# Altium schematic sheet USBtoUART.SchDoc
size A
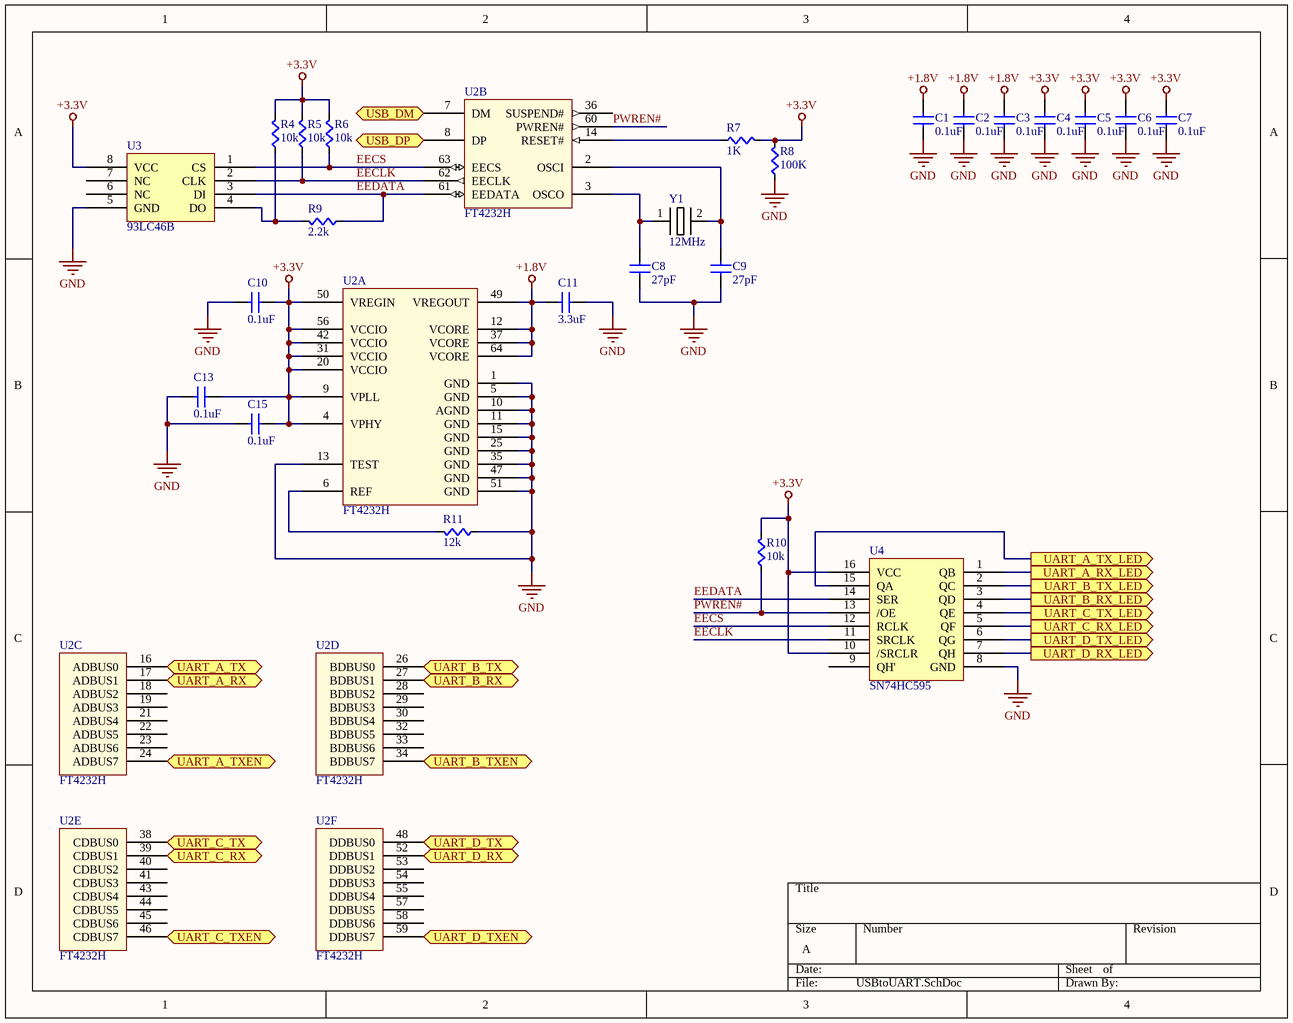
[diagram p0: USBtoUART.SchDoc]

## Parts
C1  value 0.1uF  [CAPC0603]  (hidden comment: Cap)
C2  value 0.1uF  [CAPC0603]  (hidden comment: Cap)
C3  value 0.1uF  [CAPC0603]  (hidden comment: Cap)
C4  value 0.1uF  [CAPC0603]  (hidden comment: Cap)
C5  value 0.1uF  [CAPC0603]  (hidden comment: Cap)
C6  value 0.1uF  [CAPC0603]  (hidden comment: Cap)
C7  value 0.1uF  [CAPC0603]  (hidden comment: Cap)
C8  value 27pF  [CAPC0603]  (hidden comment: Cap)
C9  value 27pF  [CAPC0603]  (hidden comment: Cap)
C10  value 0.1uF  [CAPC0603]  (hidden comment: Cap)
C11  value 3.3uF  [CAPC0603]  (hidden comment: Cap)
C13  value 0.1uF  [CAPC0603]  (hidden comment: Cap)
C15  value 0.1uF  [CAPC0603]  (hidden comment: Cap)
R4  value 10k  [RES0603]  (hidden comment: Res)
R5  value 10k  [RES0603]  (hidden comment: Res)
R6  value 10k  [RES0603]  (hidden comment: Res)
R7  value 1K  [RES0603]  (hidden comment: Res)
R8  value 100K  [RES0603]  (hidden comment: Res)
R9  value 2.2k  [RES0603]  (hidden comment: Res)
R10  value 10k  [RES0603]  (hidden comment: Res)
R11  value 12k  [RES0603]  (hidden comment: Res)
U2  FT4232H  [FT4232HL]  (parts A,B,C,D,E,F of 6)
U3  93LC46B  [SOIC-8pin]
U4  SN74HC595  [TSSOP-16pin]
Y1  12MHz  [HC49/US]

## Ports
UART_A_RX (in), UART_A_RX_LED (out), UART_A_TX (out), UART_A_TX_LED (out), UART_A_TXEN (out), UART_B_RX (in), UART_B_RX_LED (out), UART_B_TX (out), UART_B_TX_LED (out), UART_B_TXEN (out), UART_C_RX (in), UART_C_RX_LED (out), UART_C_TX (out), UART_C_TX_LED (out), UART_C_TXEN (out), UART_D_RX (in), UART_D_RX_LED (out), UART_D_TX (out), UART_D_TX_LED (out), UART_D_TXEN (out), USB_DM (bidir), USB_DP (bidir)

## Nets
+1.8V: C1.2(B) C2.2(B) C3.2(B) C11.1(A) U2.12(VCORE) U2.37(VCORE) U2.49(VREGOUT) U2.64(VCORE)
+3.3V: C4.2(B) C5.2(B) C6.2(B) C7.2(B) C10.2(B) C13.2(B) C15.1(A) R4.1(A) R5.1(A) R6.1(A) R7.1(A) R8.1(A) R10.1(A) U2.4(VPHY) U2.9(VPLL) U2.20(VCCIO) U2.31(VCCIO) U2.42(VCCIO) U2.50(VREGIN) U2.56(VCCIO) U3.8(VCC) U4.10(/SRCLR) U4.16(VCC)
GND: C1.1(A) C2.1(A) C3.1(A) C4.1(A) C5.1(A) C6.1(A) C7.1(A) C8.2(B) C9.2(B) C10.1(A) C11.2(B) C13.1(A) C15.2(B) R8.2(B) R11.2(B) U2.1(GND) U2.5(GND) U2.10(AGND) U2.11(GND) U2.13(TEST) U2.15(GND) U2.25(GND) U2.35(GND) U2.47(GND) U2.51(GND) U3.5(GND) U4.8(GND)
EECLK: R5.2(B) U2.62(EECLK) U3.2(CLK) U4.11(SRCLK)
EECS: R6.2(B) U2.63(EECS) U3.1(CS) U4.12(RCLK)
EEDATA: R9.2(B) U2.61(EEDATA) U3.3(DI) U4.14(SER)
PWREN#: R10.2(B) U2.60(PWREN#) U4.13(/OE)
UART_A_RX: U2.17(ADBUS1) ; port UART_A_RX
UART_A_RX_LED: U4.1(QB) ; port UART_A_RX_LED
UART_A_TX: U2.16(ADBUS0) ; port UART_A_TX
UART_A_TX_LED: U4.15(QA) ; port UART_A_TX_LED
UART_A_TXEN: U2.24(ADBUS7) ; port UART_A_TXEN
UART_B_RX: U2.27(BDBUS1) ; port UART_B_RX
UART_B_RX_LED: U4.3(QD) ; port UART_B_RX_LED
UART_B_TX: U2.26(BDBUS0) ; port UART_B_TX
UART_B_TX_LED: U4.2(QC) ; port UART_B_TX_LED
UART_B_TXEN: U2.34(BDBUS7) ; port UART_B_TXEN
UART_C_RX: U2.39(CDBUS1) ; port UART_C_RX
UART_C_RX_LED: U4.5(QF) ; port UART_C_RX_LED
UART_C_TX: U2.38(CDBUS0) ; port UART_C_TX
UART_C_TX_LED: U4.4(QE) ; port UART_C_TX_LED
UART_C_TXEN: U2.46(CDBUS7) ; port UART_C_TXEN
UART_D_RX: U2.52(DDBUS1) ; port UART_D_RX
UART_D_RX_LED: U4.7(QH) ; port UART_D_RX_LED
UART_D_TX: U2.48(DDBUS0) ; port UART_D_TX
UART_D_TX_LED: U4.6(QG) ; port UART_D_TX_LED
UART_D_TXEN: U2.59(DDBUS7) ; port UART_D_TXEN
USB_DM: U2.7(DM) ; port USB_DM
USB_DP: U2.8(DP) ; port USB_DP
NetC8_1: C8.1(A) U2.3(OSCO) Y1.1
NetC9_1: C9.1(A) U2.2(OSCI) Y1.2
NetR4_2: R4.2(B) R9.1(A) U3.4(DO)
NetR7_2: R7.2(B) U2.14(RESET#)
NetR11_1: R11.1(A) U2.6(REF)

Not connected (* = marked no-connect by the designer): U2 18(ADBUS2) 19(ADBUS3) 21(ADBUS4) 22(ADBUS5) 23(ADBUS6) 28(BDBUS2) 29(BDBUS3) 30(BDBUS4) 32(BDBUS5) 33(BDBUS6) 36(SUSPEND#) 40(CDBUS2) 41(CDBUS3) 43(CDBUS4) 44(CDBUS5) 45(CDBUS6) 53(DDBUS2) 54(DDBUS3) 55(DDBUS4) 57(DDBUS5) 58(DDBUS6); U3 6(NC) 7(NC); U4 9(QH')

## Library data of the parts
C1-C7 C10 C13 C15 = Cap: CAP CER 0.1UF 50V X7R 0603; Supplier 1: Digi-Key; Supplier Part Number 1: 1276-1000-1-ND
C8 C9 = Cap: CAP CER 27PF 50V NP0 0603; Supplier 1: Digi-Key; Supplier Part Number 1: 490-1413-1-ND
C11 = Cap: CAP CER 3.3UF 16V X5R 0603; Supplier 1: Digi-Key; Supplier Part Number 1: 445-7476-1-ND
R4-R6 R10 = Res: RES SMD 10K OHM 1% 1/10W 0603; Supplier 1: Digi-Key; Supplier Part Number 1: 311-10.0KHRCT-ND
R7 = Res: RES SMD 1K OHM 1% 1/10W 0603; Supplier 1: Digi-Key; Supplier Part Number 1: 311-1.00KHRCT-ND
R8 = Res: RES SMD 100K OHM 1% 1/10W 0603; Supplier 1: Digi-Key; Supplier Part Number 1: 311-100KHRCT-ND
R9 = Res: RES SMD 2.2K OHM 1% 1/10W 0603; Supplier 1: Digi-Key; Supplier Part Number 1: 311-2.20KHRCT-ND
R11 = Res: RES SMD 12K OHM 1% 1/10W 0603; Supplier 1: Digi-Key; Supplier Part Number 1: 311-12.0KHRCT-ND
U2 = FT4232H: IC USB HS QUAD UART/SYNC 64-LQFP; Supplier 1: Digi-Key; Supplier Part Number 1: 768-1026-1-ND
U3 = 93LC46B: IC EEPROM 1KBIT 2MHZ 8SOIC; Supplier 1: Digi-Key; Supplier Part Number 1: 93LC46BT-I/SNCT-ND
U4 = SN74HC595: IC 8BIT SHIFT REGISTER 16-TSSOP; Supplier 1: Digi-Key; Supplier Part Number 1: 296-23258-1-ND
Y1 = ABLS2-12.000MHZ-D4Y-T: CRYSTAL 12.0000MHZ 18PF SMD; Supplier 1: Digi-Key; Supplier Part Number 1: 535-9869-1-ND